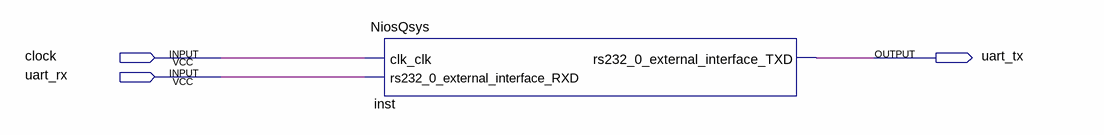
[diagram p0: schematic sheet]
// Quartus schematic produto3.bdf as structural Verilog: 1 symbols, 3 pins
module produto3 (
  input  clock,
  input  uart_rx,
  output uart_tx
);

  NiosQsys inst (.clk_clk(clock), .rs232_0_external_interface_RXD(uart_rx), .rs232_0_external_interface_TXD(uart_tx));
endmodule
